# Altium schematic sheet unity_gain_buffer.SchDoc: Unity Gain Buffer
size A4; Organization: Badgerloop; Address1: 133 Engineering Research; Address2: Building; Address3: Madison, WI 53715
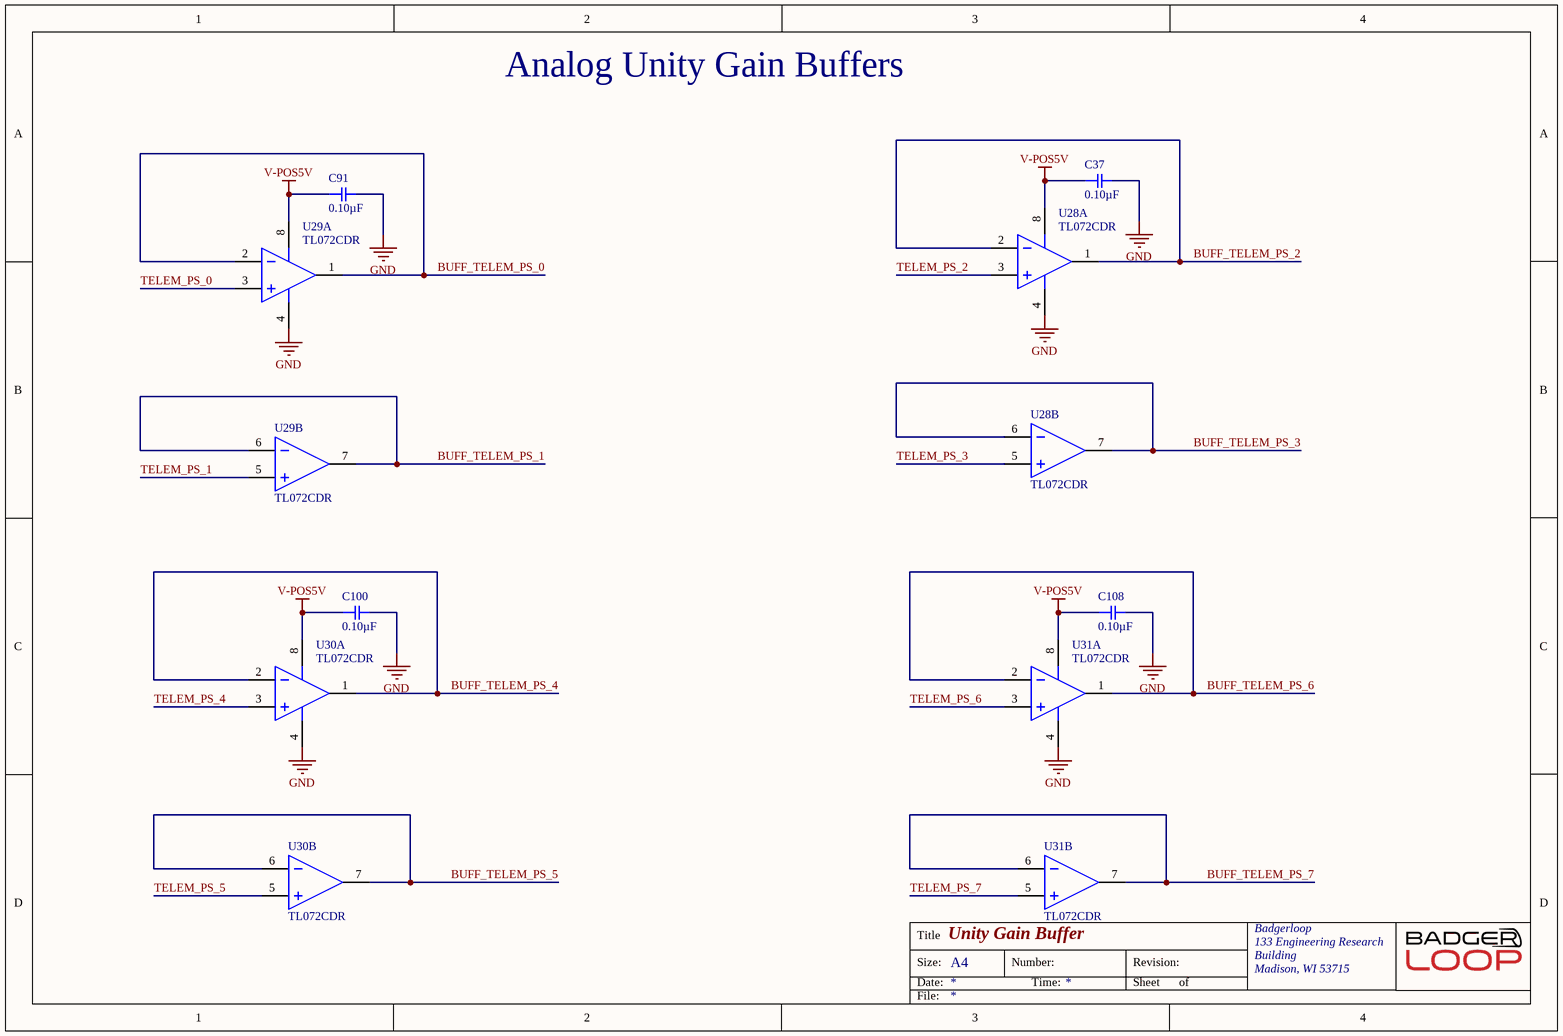
[diagram p0: unity_gain_buffer.SchDoc]

## Parts
C37  0.10µF  [SMD-0805C]
C91  0.10µF  [SMD-0805C]
C100  0.10µF  [SMD-0805C]
C108  0.10µF  [SMD-0805C]
U28  TL072CDR  [SOP127P600X175-8N]  (parts A,B of 2)
U29  TL072CDR  [SOP127P600X175-8N]  (parts A,B of 2)
U30  TL072CDR  [SOP127P600X175-8N]  (parts A,B of 2)
U31  TL072CDR  [SOP127P600X175-8N]  (parts A,B of 2)

## Nets
GND: C37.2 C91.2 C100.2 C108.2 U28.4(V-) U29.4(V-) U30.4(V-) U31.4(V-)
V-POS5V: C37.1 C91.1 C100.1 C108.1 U28.8(V+) U29.8(V+) U30.8(V+) U31.8(V+)
BUFF_TELEM_PS_0: U29.1(OUT) U29.2(IN-)
BUFF_TELEM_PS_1: U29.6(IN-) U29.7(OUT)
BUFF_TELEM_PS_2: U28.1(OUT) U28.2(IN-)
BUFF_TELEM_PS_3: U28.6(IN-) U28.7(OUT)
BUFF_TELEM_PS_4: U30.1(OUT) U30.2(IN-)
BUFF_TELEM_PS_5: U30.6(IN-) U30.7(OUT)
BUFF_TELEM_PS_6: U31.1(OUT) U31.2(IN-)
BUFF_TELEM_PS_7: U31.6(IN-) U31.7(OUT)
TELEM_PS_0: U29.3(IN+)
TELEM_PS_1: U29.5(IN+)
TELEM_PS_2: U28.3(IN+)
TELEM_PS_3: U28.5(IN+)
TELEM_PS_4: U30.3(IN+)
TELEM_PS_5: U30.5(IN+)
TELEM_PS_6: U31.3(IN+)
TELEM_PS_7: U31.5(IN+)

## Notes on the sheet
- Analog Unity Gain Buffers
- Title
- Size:
- Date:
- A4
- Number:
- Time:
- Revision:
- Sheet
- of
- File:

## Library data of the parts
C37 C91 C100 C108 = GRM21B7U1A104JA01L: CAP CER 0.1UF 10V U2J 0805; Manufacturer: Murata Electronics North America; Factory Stock: 0; Unit Price (USD): 0.4; Minimum Quantity: 1; Tolerance: ±5%; Datasheets: http://www.murata.com/~/media/webrenewal/support/library/catalog/products/capacitor/mlcc/c02e.pdf; Image: //media.digikey.com/Renders/Murata%20Renders/0805%20(2012%20Metric)%20.85mm.jpg; Digi-Key Part Number: 490-11592-1-ND; Part Number: GRM21B7U1A104JA01L; Quantity Available: 3390; @ qty: 0; Packaging: Cut Tape (CT); Series: GRM; Part Status: Active; Value: 0.10µF; Voltage: 10V; Temperature Coefficient: U2J; Operating Temperature: -55°C ~ 125°C; Features: -; Ratings: -; Applications: General Purpose; Mounting Type: Surface Mount, MLCC; Package / Case: 0805 (2012 Metric); Size / Dimension: 0.079" L x 0.049" W (2.00mm x 1.25mm); Height - Seated (Max): -; Thickness (Max): 0.053" (1.35mm); Lead Spacing: -; Lead Style: -
U28-U31 = TL072CDR: IC OPAMP JFET 3MHZ 8SOIC; Manufacturer: Texas Instruments; Voltage Gain: 106.02dB; Min Dual Supply Voltage: 3.5V; Max Dual Supply Voltage: 18V; Nominal Supply Current: 5mA; Common Mode Rejection Ratio: 70dB; Number of Channels: 2; Slew Rate: 13V/µs; Max I/O Voltage: 10mV; Input Bias Current: 200pA; Operating Supply Current: 1.4mA; Dual Supply Voltage: 9V; Supplier 1: Digi-Key; Stock 1: 21821; Pricing 1: 1=0.41, 10=0.334, 100=0.2059, 500=0.1562, 1000=0.11715 (USD); Case/Package: D; Number of Pins: 8; Contact Plating: Gold; Min Operating Temperature: -40°C; Max Operating Temperature: 85°C; Package Quantity: 1; Packaging: Tape and Reel; Unity Gain Bandwidth Product: 3MHz; Bandwidth: 3MHz; Nominal Gain Bandwidth Product: 3MHz; Number of Circuits: 2; Gain Bandwidth Product: 3MHz; Input Offset Voltage (Vos): 10mV; Number of Elements: 2; Max Supply Voltage: 18V; Number of Amplifiers: 2; Length: 4.9mm; Height: 1.58mm; Width: 3.91mm; Radiation Hardening: No; Lead Free: Lead Free; REACH SVHC: No SVHC; ComponentLink1URL: http://www.ti.com/lit/ds/symlink/tl071a.pdf?src-supplier=Digi-Key; ComponentLink1Description: http://www.ti.com/lit/ds/symlink/tl071a.pdf?src-supplier=Digi-Key; ComponentLink2URL: http://www.ti.com/general/docs/lit/getliterature.tsp?genericPartNumber=TL072&&fileType=pdf&src-supplier=Avnet; ComponentLink2Description: http://www.ti.com/general/docs/lit/getliterature.tsp?genericPartNumber=TL072&&fileType=pdf&src-supplier=Avnet; ComponentLink3URL: http://www.farnell.com/datasheets/1882732.pdf?src-supplier=Element14; ComponentLink3Description: http://www.farnell.com/datasheets/1882732.pdf?src-supplier=Element14; Supplier Part Number 1: 296-1282-6-ND